# EasyEDA schematic Bluetooth Bridge v16 Schematic EasyEDA.json
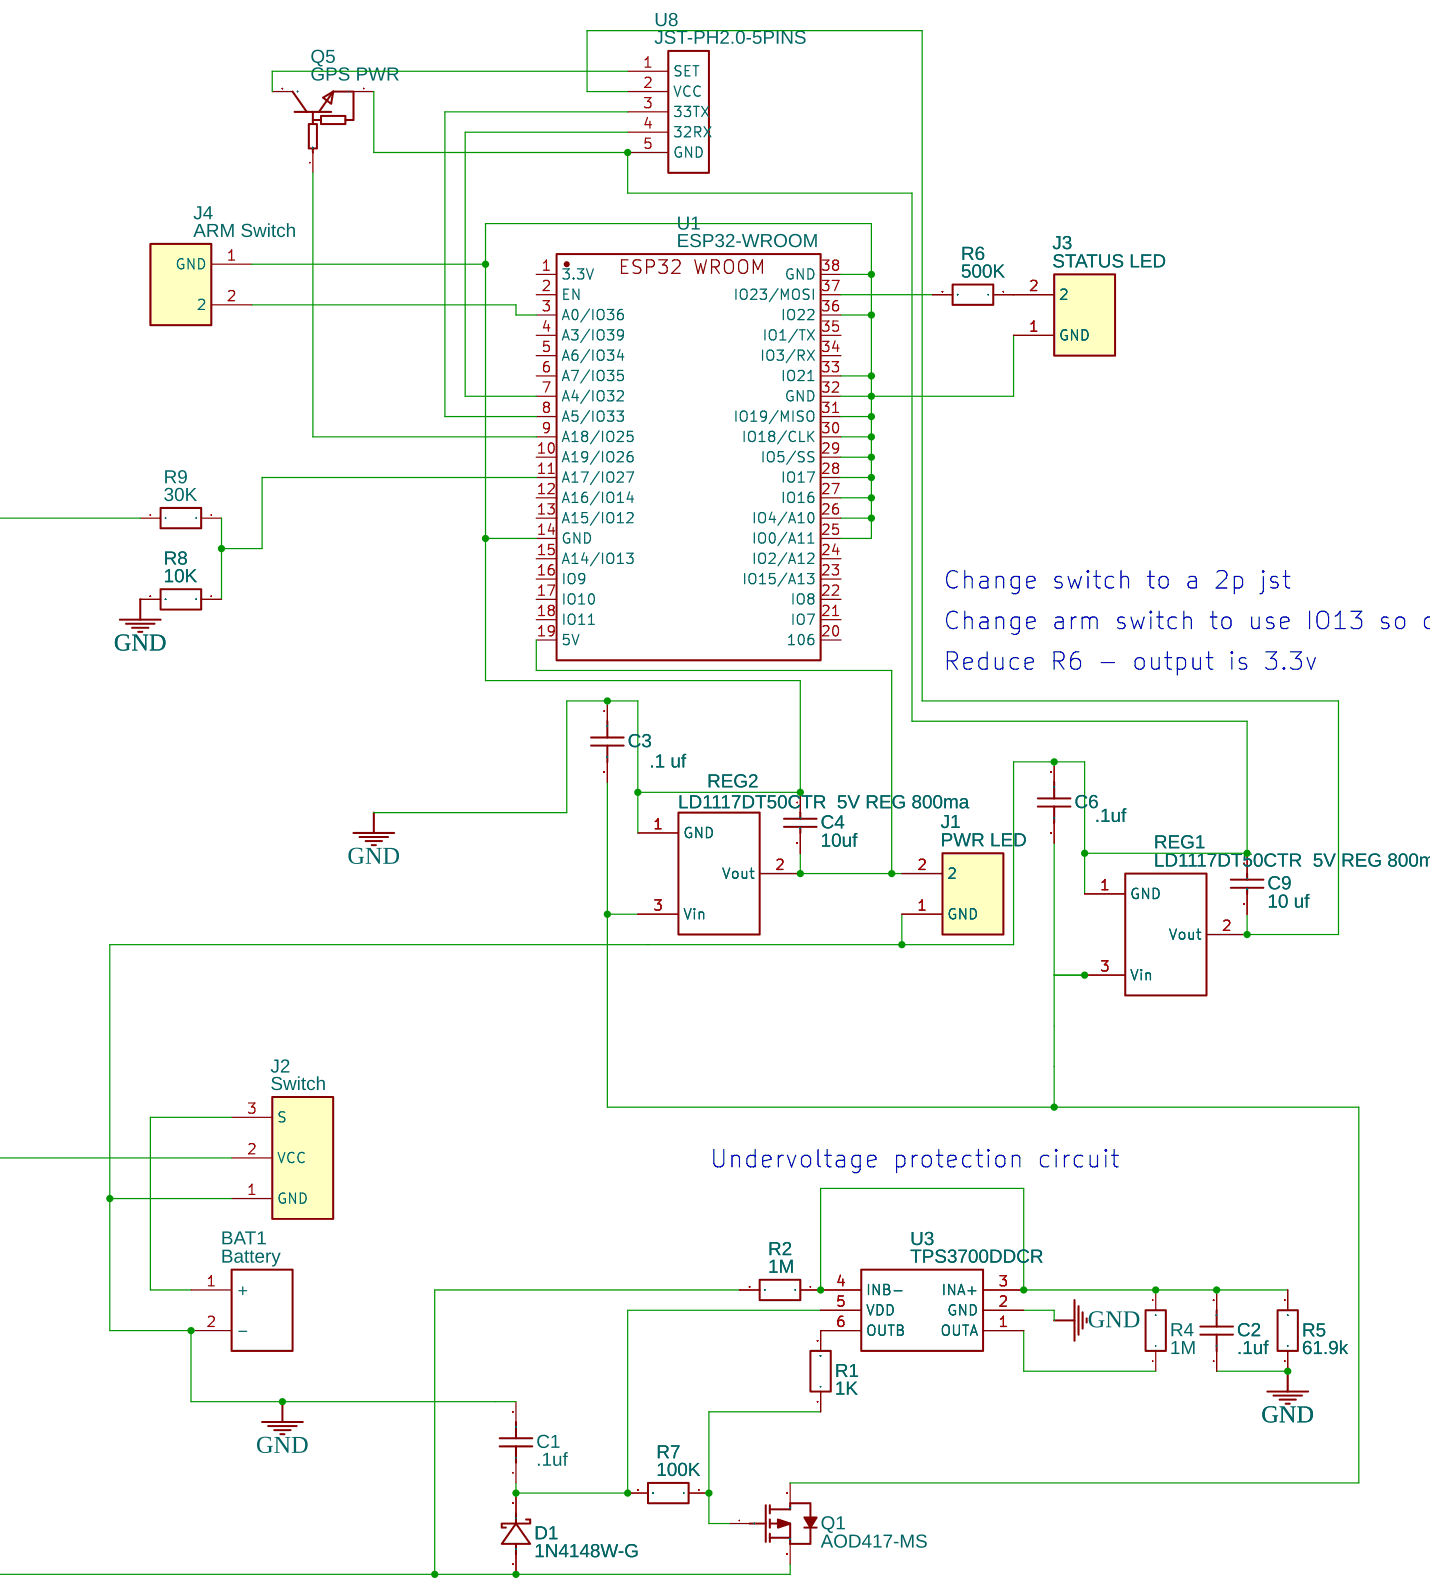
[diagram p0: schematic sheet]

## Parts
BAT1  Battery  [MKDSN1.5/2-5.08]
C1  .1uf  [C0805]
C2  .1uf  [C0805]
C3  .1 uf  [C0402]
C4  10uf  [C0402]
C6  .1uf  [C0402]
C9  10 uf  [C0402]
D1  1N4148W-G  [SOD-123_L2.8-W1.8-LS3.7-FD]
J1  PWR LED  [CONN-TH_B2B-PH-K-S]
J2  Switch  [PH-3A]
J3  STATUS LED  [CONN-TH_B2B-PH-K-S]
J4  ARM Switch  [CONN-TH_B2B-PH-K-S]
Q1  AOD417-MS  [TO-252-3_L6.6-W6.1-P4.57-LS9.9-BR-CW]
Q5  GPS PWR  [SOT-323-3_L2.0-W1.3-P1.30-LS2.1-BR]
R1  1K  [R0805]
R2  1M  [R0805]
R4  1M  [R0805]
R5  61.9k  [R0805]
R6  500K  [R0805]
R7  100K  [R0805]
R8  10K  [R0603]
R9  30K  [R0603]
REG1  LD1117DT50CTR  5V REG 800ma  [TO-252-3_L6.5-W5.8-P4.58-TL]
REG2  LD1117DT50CTR  5V REG 800ma  [TO-252-3_L6.5-W5.8-P4.58-TL]
U1  ESP32-WROOM  [ESP32 WROOM HILETGO]
U3  TPS3700DDCR  [SOT-23-6_L2.9-W1.6-P0.95-LS2.8-BL]
U8  JST-PH2.0-5PINS  [JST-PH2.0-5PINS]

## Library data of the parts
BAT1 = -: Supplier: LCSC; Manufacturer: Phoenix Contact; Supplier Part: C91153
C1 C2 = CS2012X7R105K500NRE: Supplier: LCSC; Supplier Part: C516002; Manufacturer: Samwha Capacitor; Contributor: LCSC; JLCPCB Part Class: Extended Part
C3 C6 = CC0402KRX7R6BB104: Supplier: LCSC; Supplier Part: C309458; Manufacturer: YAGEO; Contributor: LCSC; SMT Type: Extend; JLCPCB SMD: Yes; LCSC Assembly: Yes; Paste Type: expand
C4 C9 = CL05A106MQ5NUNC: Supplier: LCSC; Manufacturer: SAMSUNG; Supplier Part: C15525; SMT Type: Basic; JLCPCB SMD: Yes; LCSC Assembly: Yes; Paste Type: base
D1 = DS16W(S16)-SOD123: Supplier: LCSC; Supplier Part: C9900004842; Manufacturer: null; JLCPCB Part Class: Extended Part; link: https://cn.bing.com/search?q=datasheet%3A+%20DS16W(S16)-SOD123; Contributor: LCSC
J1 J3 J4 = B2B-PH-K-S(LF)(SN): Supplier: LCSC; Manufacturer: JST; Contributor: LCSC; Supplier Part: C131337
J2 = -: Supplier: LCSC; Manufacturer: JST; Manufacturer Part: B3B-PH-K-S(LF)(SN); Contributor: LCSC; Supplier Part: C131339
Q1 = AOD417-MS: Supplier: LCSC; Supplier Part: C2982211; Manufacturer: MSKSEMI(美森科); link: https://atta.szlcsc.comnull; Contributor: LCSC
Q5 = PDTC114EU,135: Supplier: LCSC; Supplier Part: C552153; Manufacturer: Nexperia; Contributor: LCSC; JLCPCB Part Class: Extended Part
R1 R2 R4-R7 = ERJP06J221V: Supplier: LCSC; Supplier Part: C417010; Manufacturer: PANASONIC; Contributor: LCSC
R8 R9 = SFR03EZPF1001: Supplier: LCSC; Supplier Part: C2941038; Manufacturer: ROHM(罗姆); Contributor: lcsc
REG1 REG2 = LD1117AG-12-TN3-A-R: Supplier: LCSC; Manufacturer: UTC; Supplier Part: C75487; JLCPCB Part Class: Extended Part
U1 = -: Manufacturer: HiLetgo; Manufacturer Part: 3-01-1287; Supplier: Amazon; Supplier Part: B0718T232Z; link: http://www.hiletgo.com/ProductDetail/1906566.html; Contributor: mbrinker; Package Display: No
U3 = TPS3700DDCR: Supplier: LCSC; Manufacturer: TI; Supplier Part: C33002; JLCPCB Part Class: Extended Part
U8 = JST-PH2.0-5PINS: Contributor: alieksieiev.yurii

## Nets
GND: BAT1.2(-) C1.2 C2.1 C3.1 C4.1 C6.1 C9.1 J1.1(GND) J2.1(GND) J3.1(GND) J4.1(GND) Q5.2(E) R5.1 R8.2 REG1.1(GND) REG2.1(GND) U1.14(GND) U1.25(IO0/A11) U1.26(IO4/A10) U1.27(IO16) U1.28(IO17) U1.29(IO5/SS) U1.30(IO18/CLK) U1.31(IO19/MISO) U1.32(GND) U1.33(IO21) U1.36(IO22) U1.38(GND) U3.2(GND) U8.5(GND)
Net-(BAT1-1): BAT1.1(+) J2.3(S)
Net-(C1-1): C1.1 D1.2(K) R7.2 U3.5(VDD)
Net-(C2-2): C2.2 R2.1 R4.2 R5.2 U3.3(INA+) U3.4(INB-)
Net-(C3-2): C3.2 C6.2 Q1.2(D) REG1.3(Vin) REG2.3(Vin)
Net-(C4-2): C4.2 J1.2 REG2.2(Vout) U1.19(5V)
Net-(C9-2): C9.2 REG1.2(Vout) U8.2(VCC)
Net-(D1-1): D1.1(A) J2.2(VCC) Q1.3(S) R2.2 R9.2
Net-(J3-2): J3.2 R6.1
Net-(J4-2): J4.2 U1.3(A0/IO36)
Net-(Q1-1): Q1.1(G) R1.1 R7.1
Net-(Q5-1): Q5.1(B) U1.9(A18/IO25)
Net-(Q5-3): Q5.3(C) U8.1(SET)
Net-(R1-2): R1.2 U3.6(OUTB)
Net-(R4-1): R4.1 U3.1(OUTA)
Net-(R6-2): R6.2 U1.37(IO23/MOSI)
Net-(R8-1): R8.1 R9.1 U1.11(A17/IO27)
Net-(U1-7): U1.7(A4/IO32) U8.4(32RX)
Net-(U1-8): U1.8(A5/IO33) U8.3(33TX)

Not connected (* = marked no-connect by the designer): U1 1(3.3V) 2(EN) 4(A3/IO39) 5(A6/IO34) 6(A7/IO35) 10(A19/IO26) 12(A16/IO14) 13(A15/IO12) 15(A14/IO13) 16(IO9) 17(IO10) 18(IO11) 20(106) 21(IO7) 22(IO8) 23(IO15/A13) 24(IO2/A12) 34(IO3/RX) 35(IO1/TX)

## Notes on the sheet
- Change switch to a 2p jst
- Change arm switch to use IO13 so can internal pullup
- Reduce R6 - output is 3.3v
- Undervoltage protection circuit
